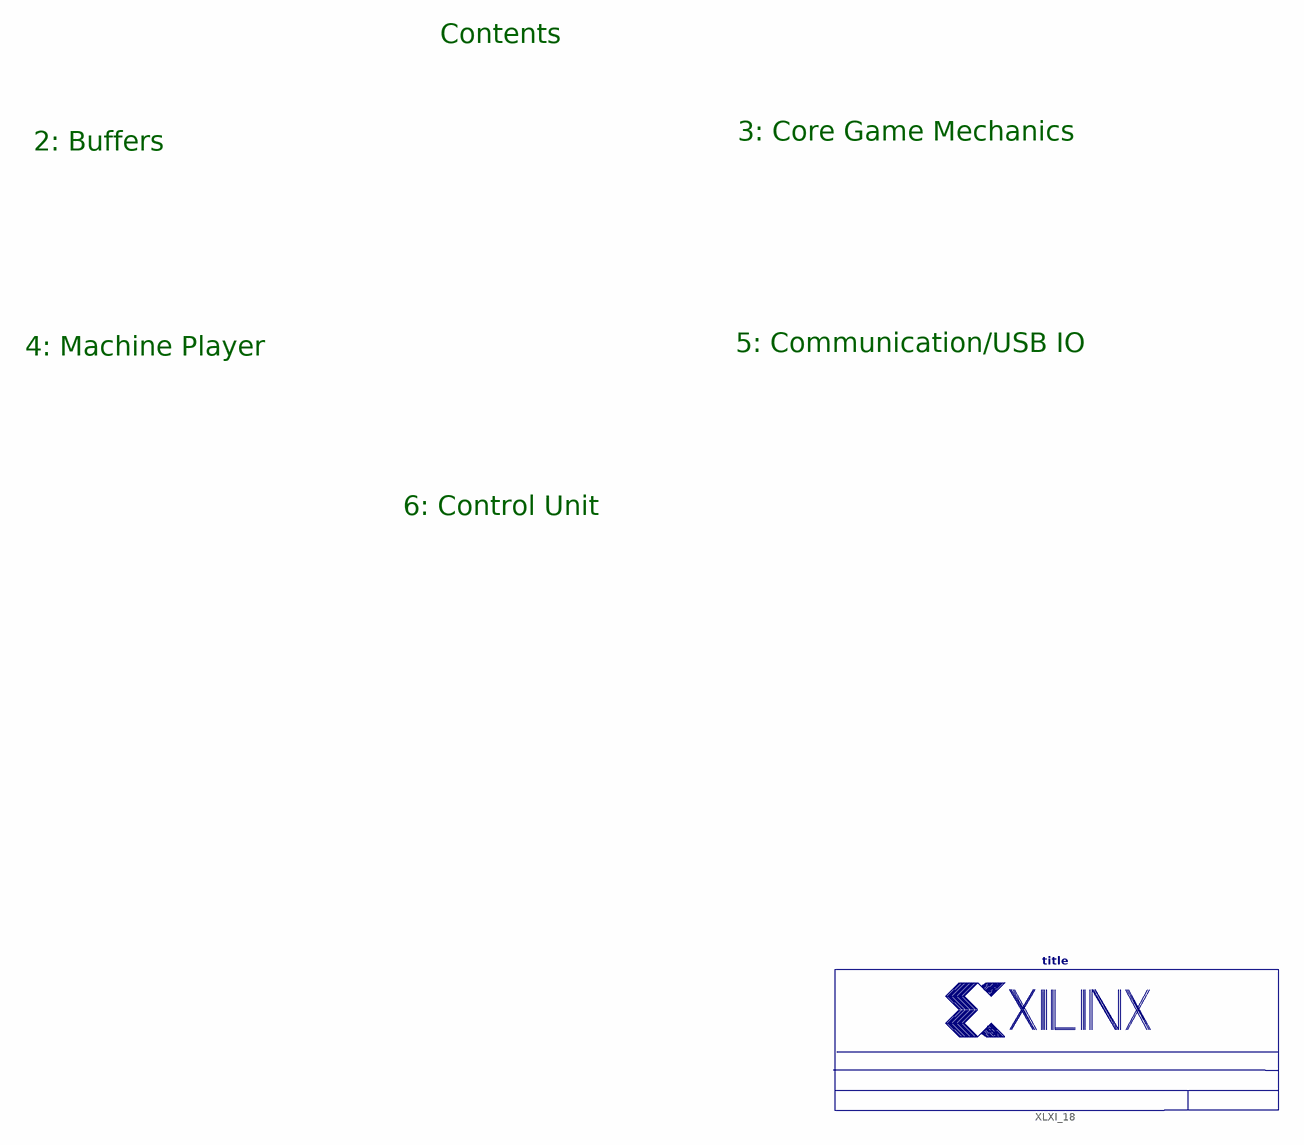
[diagram p0: schematic sheet 1]
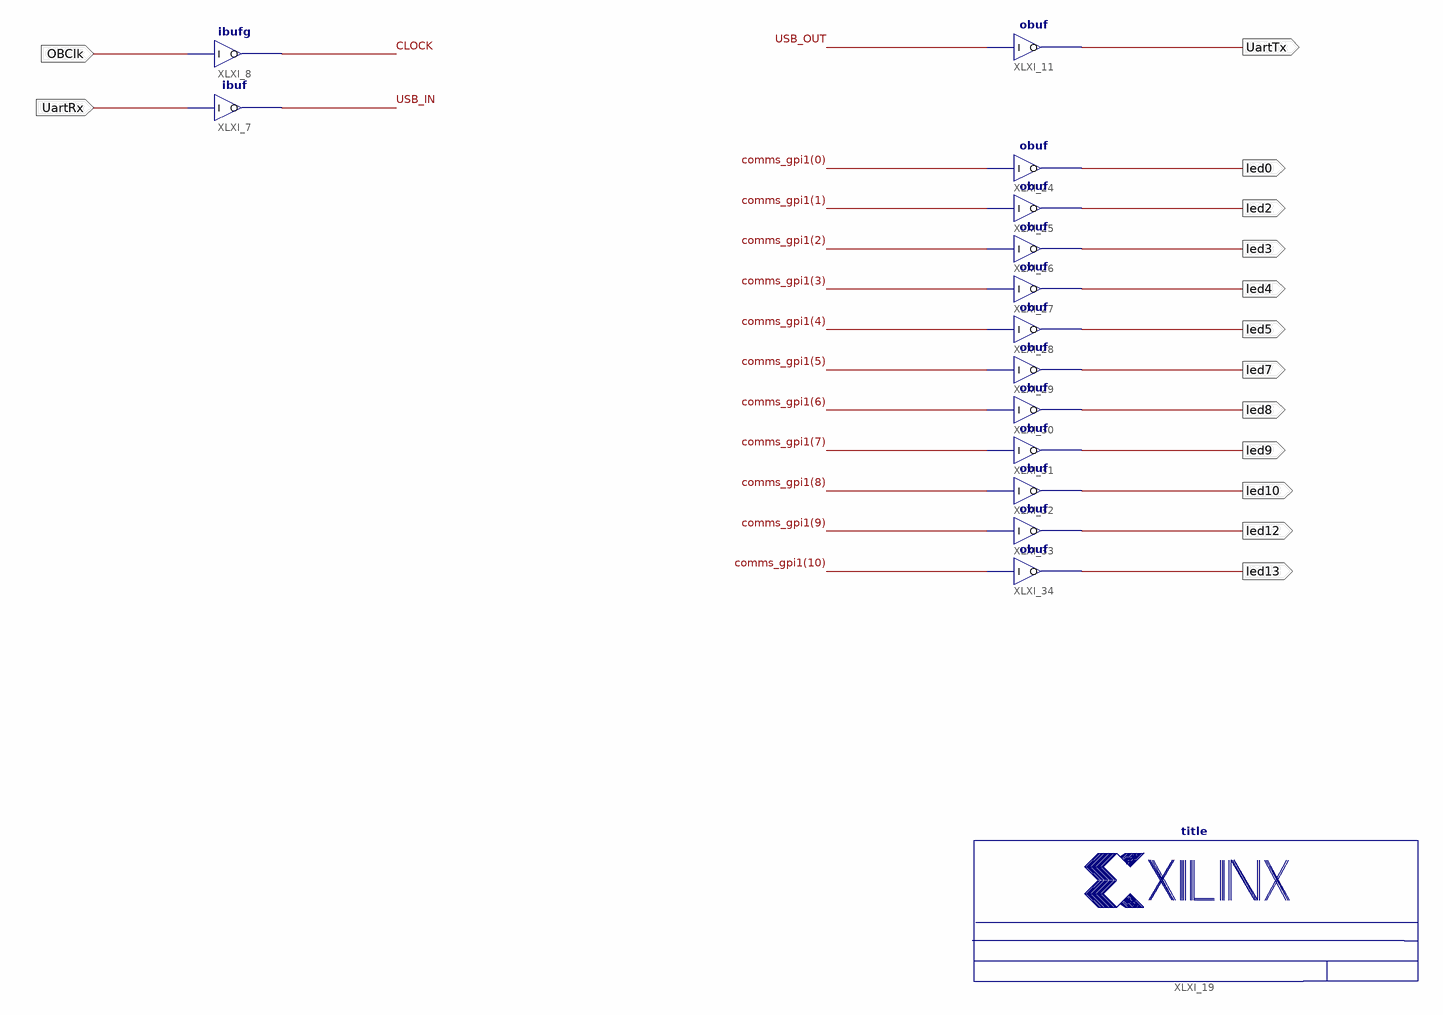
[diagram p1: schematic sheet 2]
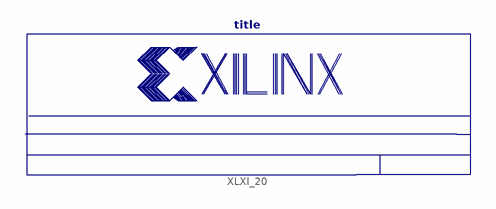
[diagram p2: schematic sheet 3]
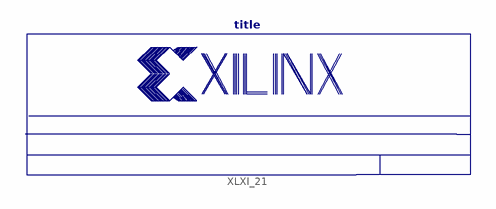
[diagram p3: schematic sheet 4]
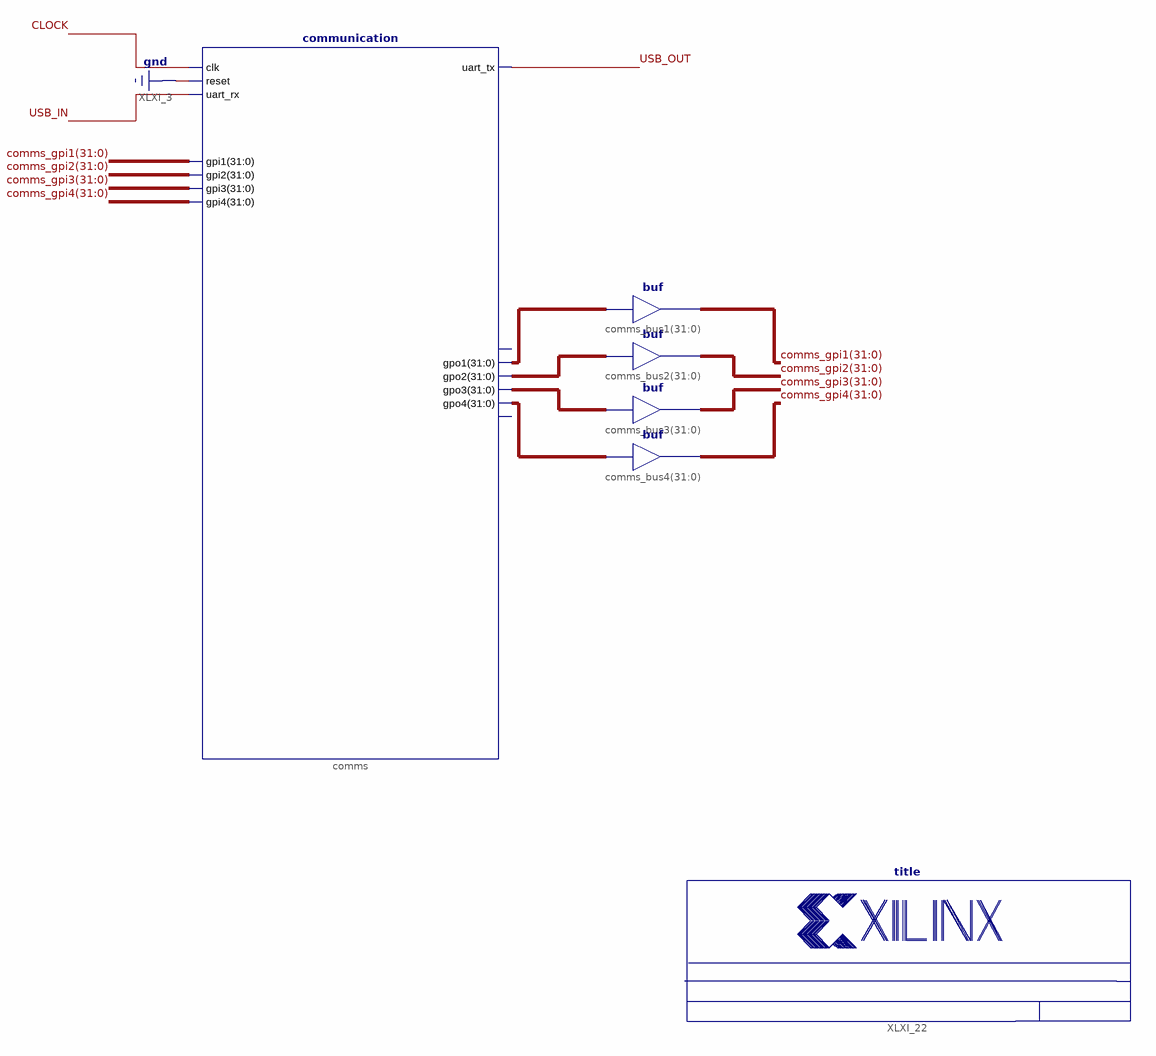
[diagram p4: schematic sheet 5]
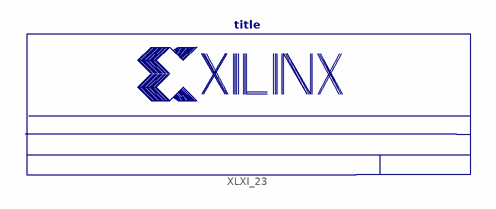
[diagram p5: schematic sheet 6]
// Xilinx ISE schematic gomoku.sch (artix7) as structural Verilog: 25 symbols, 14 ports
module gomoku (
  input  OBClk,
  input  UartRx,
  output UartTx,
  output led0,
  output led2,
  output led3,
  output led4,
  output led5,
  output led7,
  output led8,
  output led9,
  output led10,
  output led12,
  output led13
);

  wire CLOCK, USB_IN, USB_OUT;
  wire [31:0] comms_gpi1, comms_gpi2, comms_gpi3, comms_gpi4, comms_gpo1, comms_gpo2, comms_gpo3, comms_gpo4;

  ibuf XLXI_7 (.I(UartRx), .O(USB_IN));
  ibufg XLXI_8 (.I(OBClk), .O(CLOCK));
  obuf XLXI_11 (.I(USB_OUT), .O(UartTx));
  title #(.TitleFieldText("Gomoku 1.0.0"), .NameFieldText("Ana, Kenan, Xikun, Varron")) XLXI_18 ();
  title #(.TitleFieldText("Gomoku 1.0.0"), .NameFieldText("Ana, Kenan, Xikun, Varron")) XLXI_19 ();
  title #(.TitleFieldText("Gomoku 1.0.0"), .NameFieldText("Ana, Kenan, Xikun, Varron")) XLXI_20 ();
  title #(.TitleFieldText("Gomoku 1.0.0"), .NameFieldText("Ana, Kenan, Xikun, Varron")) XLXI_21 ();
  title #(.TitleFieldText("Gomoku 1.0.0"), .NameFieldText("Ana, Kenan, Xikun, Varron")) XLXI_22 ();
  title #(.TitleFieldText("Gomoku 1.0.0"), .NameFieldText("Ana, Kenan, Xikun, Varron")) XLXI_23 ();
  communication comms (
    .clk(CLOCK), .reset(1'b0), .uart_tx(USB_OUT), .uart_rx(USB_IN), .gpi1(comms_gpi1), .gpi2(comms_gpi2),
    .gpi3(comms_gpi3), .gpi4(comms_gpi4), .gpo1(comms_gpo1), .gpo2(comms_gpo2), .gpo3(comms_gpo3),
    .gpo4(comms_gpo4));  // open: uart_interrupt, intc_irq
  assign comms_gpi1 = comms_gpo1;  // buf comms_bus1[31..0], 32 bits wide
  assign comms_gpi2 = comms_gpo2;  // buf comms_bus2[31..0], 32 bits wide
  assign comms_gpi3 = comms_gpo3;  // buf comms_bus3[31..0], 32 bits wide
  assign comms_gpi4 = comms_gpo4;  // buf comms_bus4[31..0], 32 bits wide
  obuf XLXI_24 (.I(comms_gpi1[0]), .O(led0));
  obuf XLXI_25 (.I(comms_gpi1[1]), .O(led2));
  obuf XLXI_26 (.I(comms_gpi1[2]), .O(led3));
  obuf XLXI_27 (.I(comms_gpi1[3]), .O(led4));
  obuf XLXI_28 (.I(comms_gpi1[4]), .O(led5));
  obuf XLXI_29 (.I(comms_gpi1[5]), .O(led7));
  obuf XLXI_30 (.I(comms_gpi1[6]), .O(led8));
  obuf XLXI_31 (.I(comms_gpi1[7]), .O(led9));
  obuf XLXI_32 (.I(comms_gpi1[8]), .O(led10));
  obuf XLXI_33 (.I(comms_gpi1[9]), .O(led12));
  obuf XLXI_34 (.I(comms_gpi1[10]), .O(led13));

  // Notes on the sheet:
  //   Contents
  //   3: Core Game Mechanics
  //   2: Buffers
  //   5: Communication/USB IO
  //   4: Machine Player
  //   6: Control Unit
endmodule
